# EAGLE design NFC Shield (EAGLE 6.3)
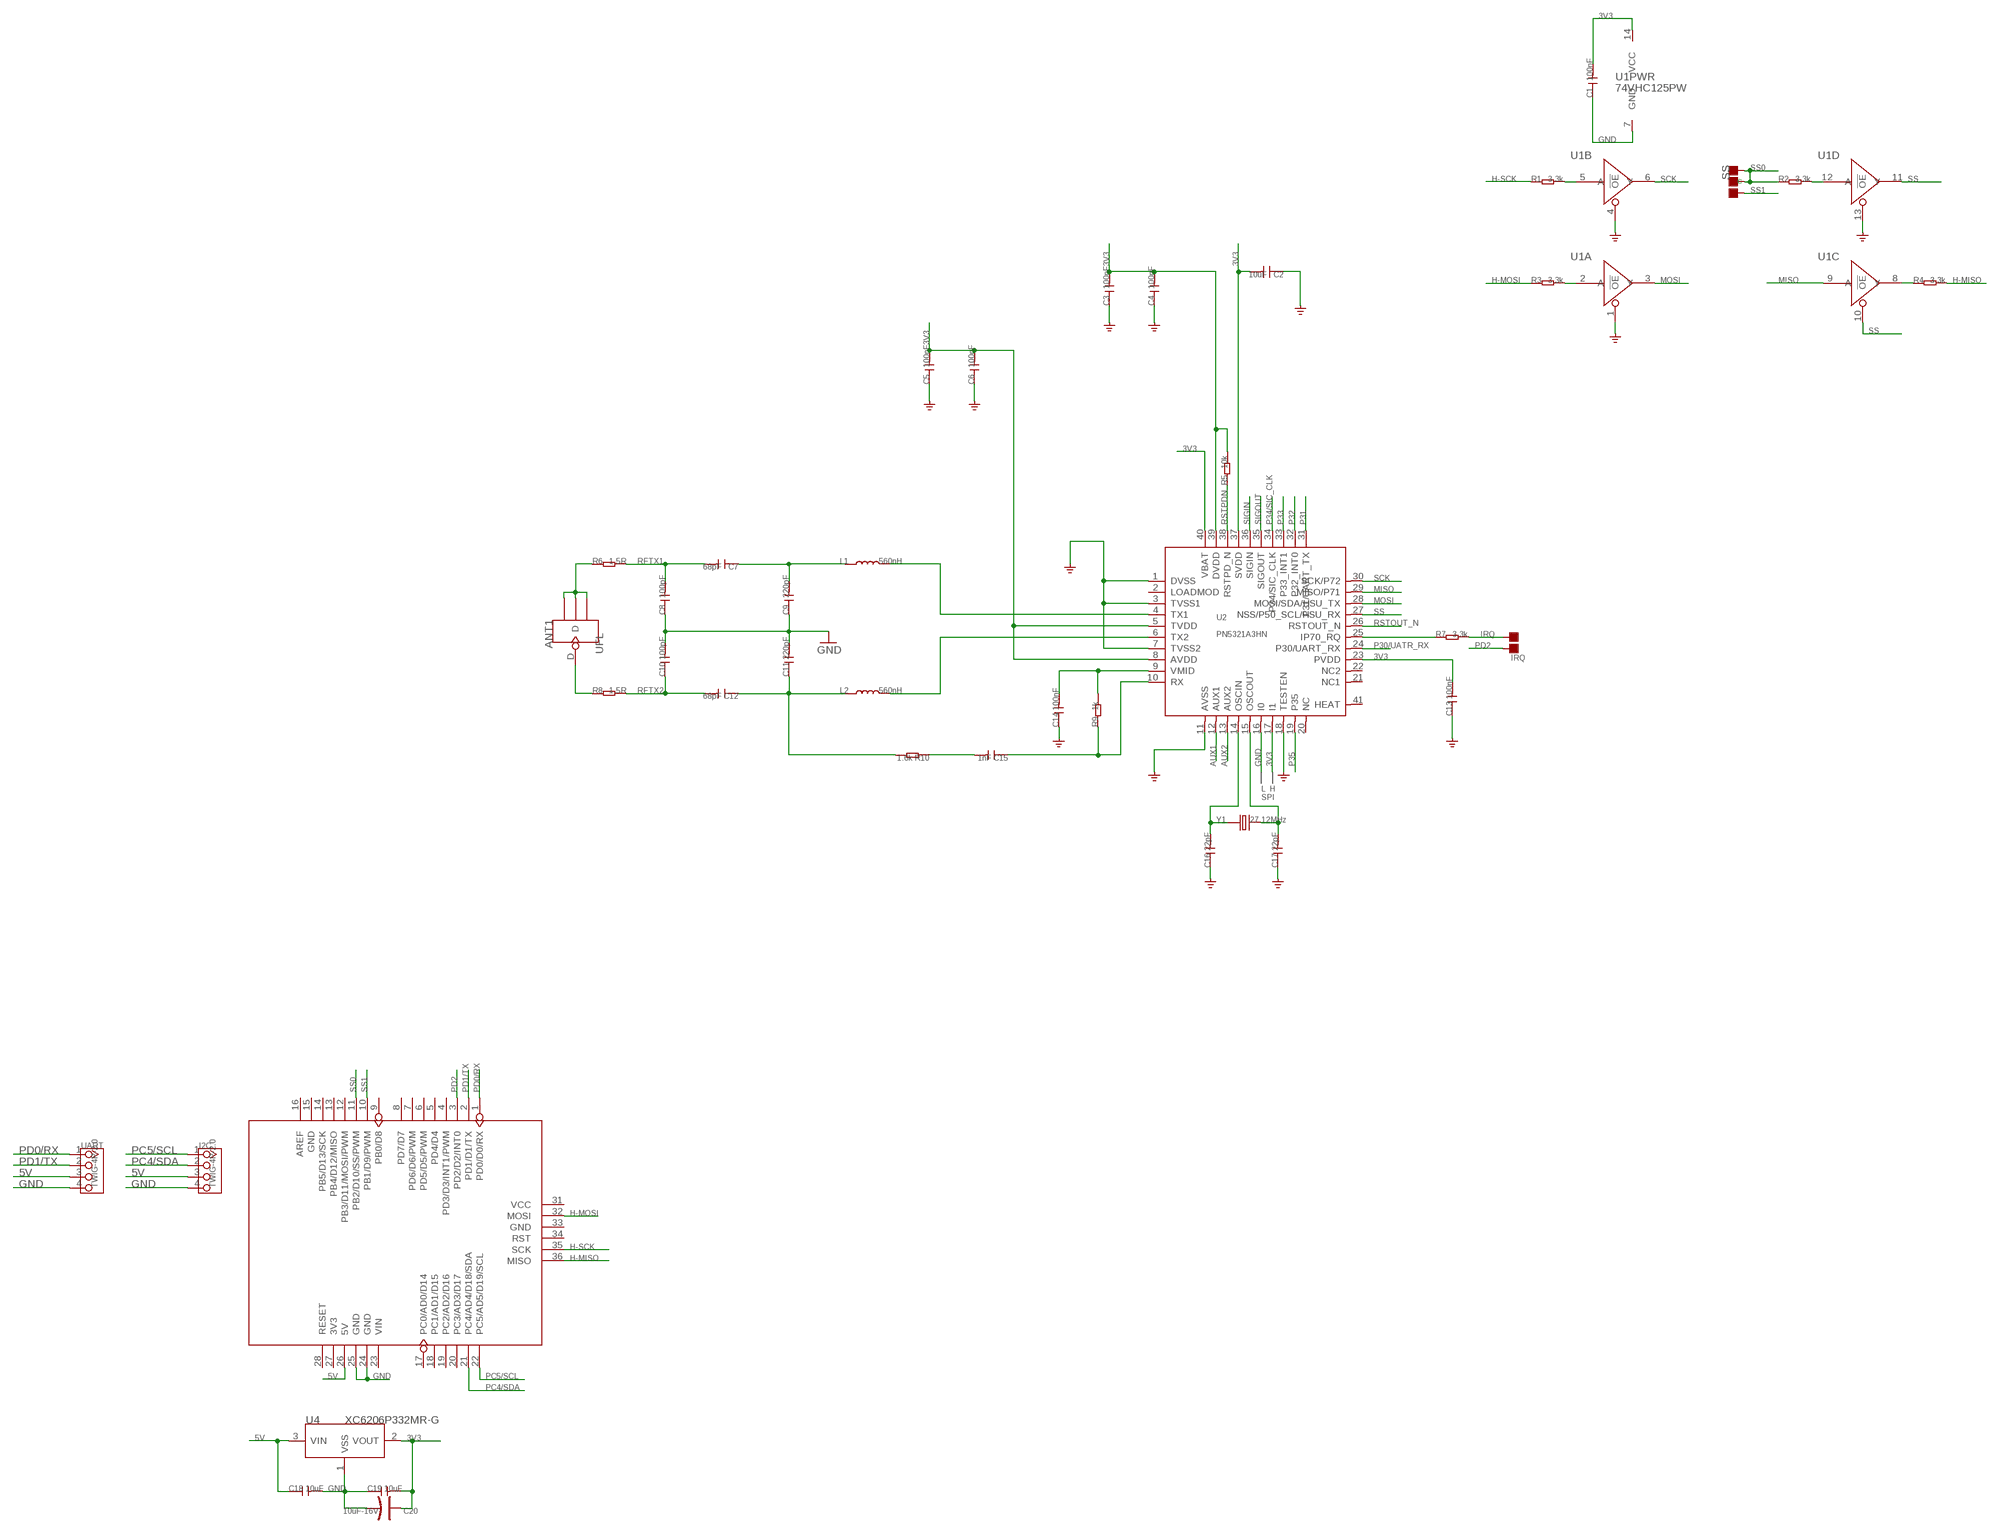
[diagram p0: schematic, sheet 1]

## Parts
ANT1  UFL  ANTENNA-U-FL  [4P-U-FL]
C1  100nF  C-0603  [C0603]
C2  10uF  C-0805  [0805]
C3  100nF  C-0603  [C0603]
C4  100nF  C-0603  [C0603]
C5  100nF  C-0603  [C0603]
C6  100nF  C-0603  [C0603]
C7  68pF  C-0603  [C0603]
C8  100pF  C-0603  [C0603]
C9  220pF  C-0603  [C0603]
C10  100pF  C-0603  [C0603]
C11  220pF  C-0603  [C0603]
C12  68pF  C-0603  [C0603]
C13  100nF  C-0603  [C0603]
C14  100nF  C-0603  [C0603]
C15  1nF  C-0603  [C0603]
C16  22pF  C-0603  [C0603]
C17  22pF  C-0603  [C0603]
C18  10uF  C-0805  [C0805]
C19  10uF  C-0805  [C0805]
C20  10uF-16V  CAP-AVX-A  [AVX-A]
I2C  TWIG-4P-2.0  TWIG-4P-2.0-2.0  [4P-2.0]
IRQ  DNP  PAD-JUMPER-2P  [2P-SMD-1.78X1.27]
L1  560nH  L'0805'  [L0805]
L2  560nH  L'0805'  [L0805]
R1  3.3k  R-0603  [R0603]
R2  3.3k  R-0603  [R0603]
R3  3.3k  R-0603  [R0603]
R4  3.3k  R-0603  [R0603]
R5  10k  R-0603  [R0603]
R6  1.5R  R-0603  [R0603]
R7  3.3k  R-0603  [R0603]
R8  1.5R  R-0603  [R0603]
R9  1k  R-0603  [R0603]
R10  1.6k  R-0603  [R0603]
SS  DNP  PAD-JUMPER-3P-40*40  [3P-SMD-4.1X1.5]
U1  74VHC125PW  [TSSOP14]
U2  PN5321A3HN  PN532-HVQFN40  [HVQFN40]
U3  ARDUINO'W/-SILK  [ARDUINO]
U4  XC6206P332MR-G  XC6206MR  [SOT23]
UART  TWIG-4P-2.0  TWIG-4P-2.0-2.0  [4P-2.0]
Y1  27.12MHz  CRYSTAL'HC49S'  [HC49/S]

## Nets
3V3: C1.2 C2.2 C3.2 C4.2 C5.2 C6.2 C13.2 C19.2 C20.+ R5.2 U1.14(PWR:VCC) U2.5(TVDD) U2.8(AVDD) U2.17(I1) U2.23(PVDD) U2.37(SVDD) U2.39(DVDD) U2.40(VBAT) U4.2(VOUT)
5V: C18.1 I2C.3 U3.26(5V) U4.3(VIN) UART.3
AUX1: U2.12(AUX1)
AUX2: U2.13(AUX2)
GND: C1.1 C2.1 C3.1 C4.1 C5.1 C6.1 C8.1 C9.1 C10.2 C11.2 C13.1 C14.1 C16.1 C17.1 C18.2 C19.1 C20.- I2C.4 U1.1(A:!OE) U1.4(B:!OE) U1.7(PWR:GND) U1.13(D:!OE) U2.1(DVSS) U2.3(TVSS1) U2.7(TVSS2) U2.11(AVSS) U2.16(I0) U2.18(TESTEN) U3.24(GND) U3.25(GND) U4.1(VSS) UART.4
H-MISO: R4.2 U3.36(MISO)
H-MOSI: R3.1 U3.32(MOSI)
H-SCK: R1.1 U3.35(SCK)
IRQ: IRQ.1 R7.2
MISO: U1.9(C:A) U2.29(MISO/P71)
MOSI: U1.3(A:Y) U2.28(MOSI/SDA/HSU_TX)
N$1: C16.2 U2.14(OSCIN) Y1.1
N$2: C17.2 U2.15(OSCOUT) Y1.2
N$3: L2.2 U2.6(TX2)
N$4: L1.2 U2.4(TX1)
N$5: C7.1 C9.2 L1.1
N$6: C15.2 R10.1
N$7: C11.1 C12.1 L2.1 R10.2
N$8: R1.2 U1.5(B:A)
N$9: C14.2 R9.2 U2.9(VMID)
N$10: R2.2 U1.12(D:A)
N$11: C15.1 R9.1 U2.10(RX)
N$12: R4.1 U1.8(C:Y)
N$13: R3.2 U1.2(A:A)
N$14: R7.1 U2.25(IP70_RQ)
N$17: ANT1.D R8.1
N$18: ANT1.GND1 ANT1.GND2 ANT1.GND3 R6.1
P30/UATR_RX: U2.24(P30/UART_RX)
P31: U2.31(P31/UART_TX)
P32: U2.32(P32_INT0)
P33: U2.33(P33_INT1)
P34/SIC_CLK: U2.34(P34/SIC_CLK)
P35: U2.19(P35)
PC4/SDA: I2C.2 U3.21(PC4/AD4/D18/SDA)
PC5/SCL: I2C.1 U3.22(PC5/AD5/D19/SCL)
PD0/RX: U3.1(PD0/D0/RX) UART.1
PD1/TX: U3.2(PD1/D1/TX) UART.2
PD2: IRQ.2 U3.3(PD2/D2/INT0)
RFTX1: C7.2 C8.2 R6.2
RFTX2: C10.1 C12.2 R8.2
RSTOUT_N: U2.26(RSTOUT_N)
RSTPDN: R5.1 U2.38(RSTPD_N)
SCK: U1.6(B:Y) U2.30(SCK/P72)
SIGIN: U2.36(SIGIN)
SIGOUT: U2.35(SIGOUT)
SS: U1.10(C:!OE) U1.11(D:Y) U2.27(NSS/P50_SCL/HSU_RX)
SS0: R2.1 SS.11(R) SS.MM(C) U3.11(PB2/D10/SS/PWM)
SS1: SS.00(L) U3.10(PB1/D9/PWM)
Unconnected: U2.2(LOADMOD) U2.20(NC) U2.21(NC1) U2.22(NC2) U2.41(HEAT) U3.4(PD3/D3/INT1/PWM) U3.5(PD4/D4) U3.6(PD5/D5/PWM) U3.7(PD6/D6/PWM) U3.8(PD7/D7) U3.9(PB0/D8) U3.12(PB3/D11/MOSI/PWM) U3.13(PB4/D12/MISO) U3.14(PB5/D13/SCK) U3.15(GND) U3.16(AREF) U3.17(PC0/AD0/D14) U3.18(PC1/AD1/D15) U3.19(PC2/AD2/D16) U3.20(PC3/AD3/D17) U3.23(VIN) U3.27(3V3) U3.28(RESET) U3.31(VCC) U3.33(GND) U3.34(RST)

## Notes on the sheet
- L | H
- SPI

## Library data of the parts
ANT1 = Connector:ANTENNA-U-FL
C1 C3-C19 = Discrete:C*: Ceramic Capacitors
C2 = Discreter:C*: Ceramic Capacitors
C20 = Discrete:CAP*: Electrolytic Capacitors,Tantalum Capacitors and Super Capacitors
I2C UART = Connector:TWIG-4P-2.0
IRQ = Discrete:PAD-JUMPER-2P; PARTNO: DNP
L1 L2 = Discrete:L*
R1-R10 = Discrete:R*
SS = Discrete:PAD-JUMPER-3P; PARTNO: DNP
U1 = IC:74V*125: Quad Buffer/Line Driver;3-state
U2 = IC:PN532: NFC Controller http://www.adafruit.com/datasheets/pn532ds.pdf
U3 = moudle:ARDUINO
U4 = IC:XC6206: LOW ESR Cap.Compatible Positive Voltage Regulators
Y1 = Discrete:CRYSTAL*: CRYSTAL

## Net classes
0 default: width 0.203 mm, drill 0.305 mm, clearance 0.152 mm
3 usbvcc: width 0.203 mm, drill 0.305 mm, clearance 0.203 mm

## Board
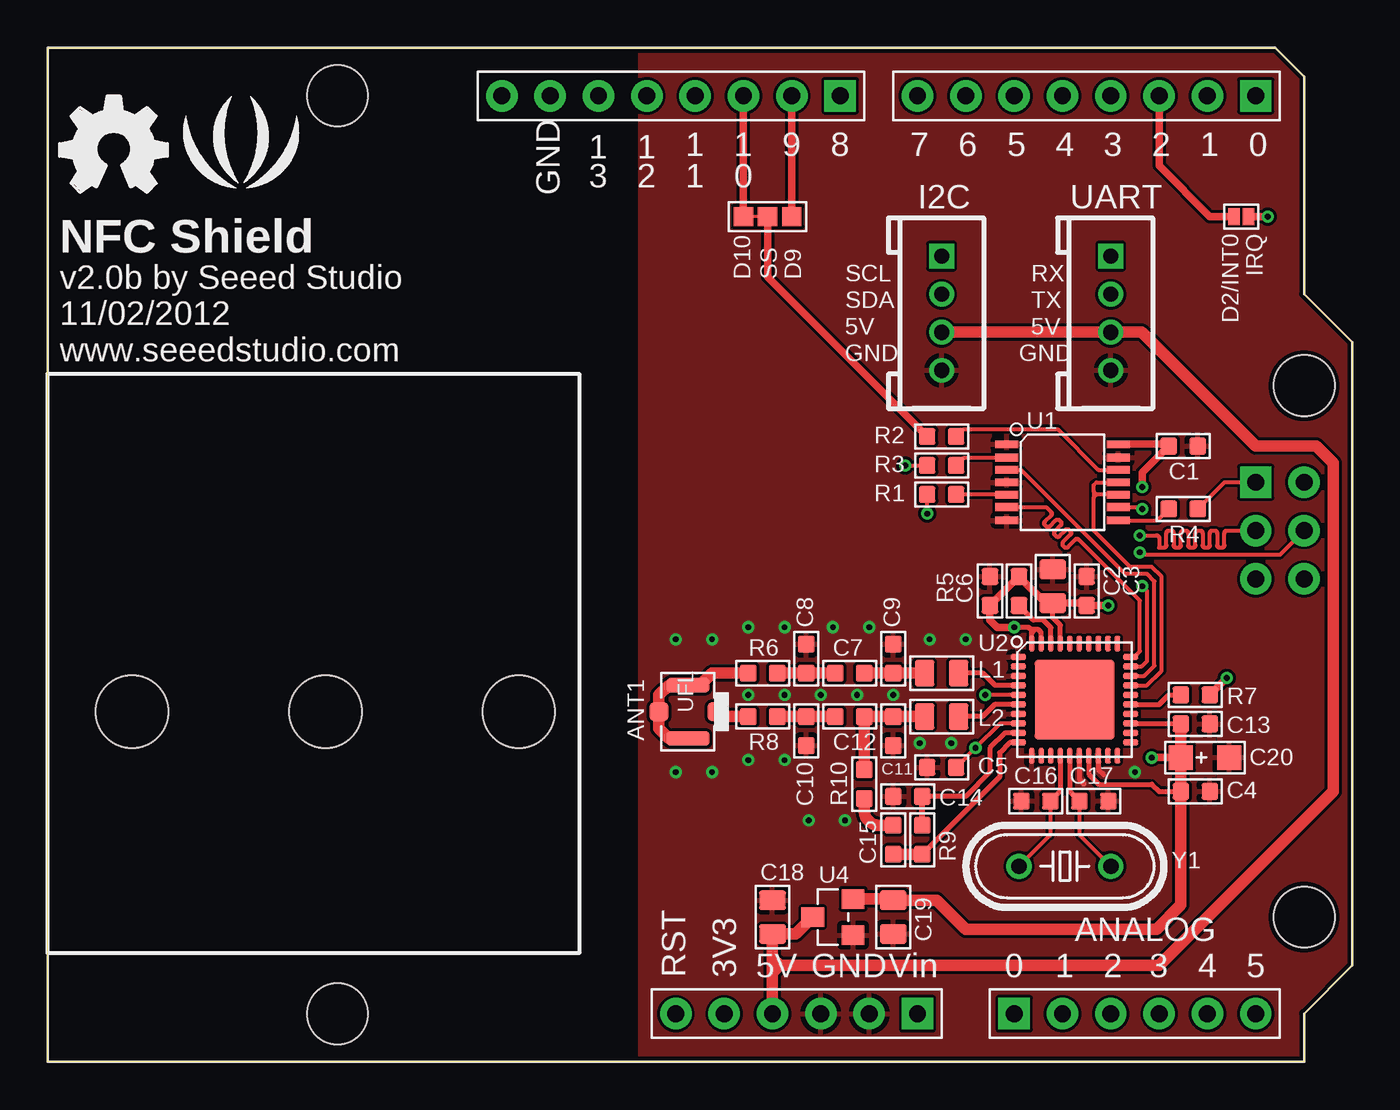
[diagram p1: board, top side]
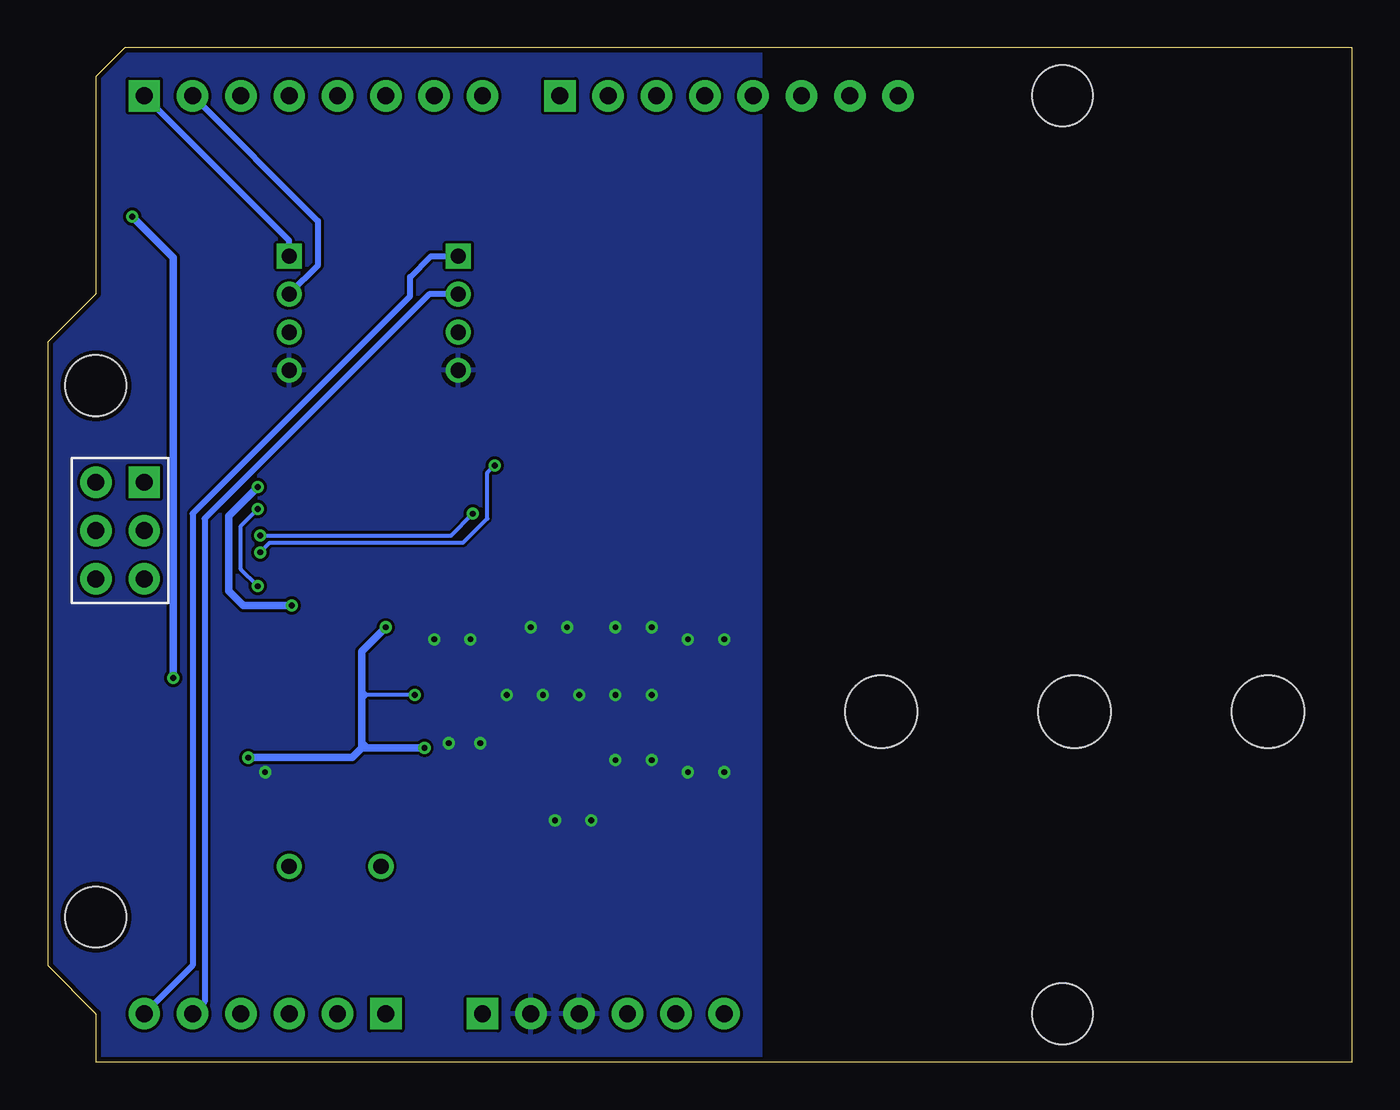
[diagram p2: board, bottom side, seen from below]

Size 68.58 x 53.34 mm. Coordinates in mm from the lower left corner, seen from the top.
Outline: 0,53.34 64.52,53.34 66.04,51.82 66.04,40.39 68.58,37.85 68.58,5.08 66.04,2.54 66.04,0 0,0 0,53.34
Copper layers (1*16): Top 0.035mm / dielectric 1.5mm / Bottom 0.035mm
Design rules "SeeedStudio_rule_no_angle_090911 *": minimum track width 6mil, minimum drill 12mil, track to track 6mil, track to pad 6mil, pad to pad 6mil, via to via 6mil, smd to smd 0mil, copper to edge 10mil, drill to drill 10mil, minimum pad ring 10mil, minimum via ring 6mil, stop-mask expansion 2mil, vias tented up to drill 100mil, thermal gap 10mil
Holes 3.81 mm at 24.77,18.41 14.61,18.41 4.45,18.41
Holes 3.2 mm at 15.24,2.54
tRestrict: area 0,0 to 30.5,33; area 51.4,16.5 to 56.5,21.6
bRestrict: area 0,0 to 30.5,33

### Footprints (pad centres in the part's own frame; a part is rotated, then mirrored left to right if it is on the bottom)
4P-U-FL = smd 1.016 x 1.016: D -1.524,0; GND3 1.524,0 | smd 2.286 x 0.762: GND1 0,1.397; GND2 0,-1.397
C0603 = smd 0.889 x 0.889: 1 -0.762,0; 2 0.762,0
0805 = smd 1.016 x 1.397: 1 -0.889,0; 2 0.889,0
C0805 = smd 1.016 x 1.397: 1 -0.889,0; 2 0.889,0
AVX-A = smd 1.27 x 1.27: + -1.27,0; - 1.27,0
4P-2.0 = drill 0.8 pad 1.27 square: 1 -3,0 | drill 0.8 pad 1.27: 2 -1,0; 3 1,0; 4 3,0
2P-SMD-1.78X1.27 = smd 0.889 x 0.61: 1 0,0.381; 2 0,-0.381
L0805 = smd 1.016 x 1.397: 1 -0.889,0; 2 0.889,0
R0603 = smd 0.889 x 0.889: 1 -0.762,0; 2 0.762,0
3P-SMD-4.1X1.5 = smd 1.016 x 1.016: 00 -1.27,0; 11 1.27,0; MM 0,0
TSSOP14 = smd 0.4 x 1.2: 1 -2,-2.925; 2 -1.3,-2.925; 3 -0.65,-2.925; 4 0,-2.925; 5 0.65,-2.925; 6 1.3,-2.925; 7 2,-2.925; 8 2,2.925; 9 1.3,2.925; 10 0.65,2.925; 11 0,2.925; 12 -0.65,2.925; 13 -1.3,2.925; 14 -2,2.925
HVQFN40 = smd 0.8 x 0.3: 1 -2.95,2.25; 2 -2.95,1.75; 3 -2.95,1.25; 4 -2.95,0.75; 5 -2.95,0.25; 6 -2.95,-0.25; 7 -2.95,-0.75; 8 -2.95,-1.25; 9 -2.95,-1.75; 10 -2.95,-2.25; 21 2.95,-2.25; 22 2.95,-1.75; 23 2.95,-1.25; 24 2.95,-0.75; 25 2.95,-0.25; 26 2.95,0.25; 27 2.95,0.75; 28 2.95,1.25; 29 2.95,1.75; 30 2.95,2.25 | smd 0.3 x 0.8: 11 -2.25,-2.95; 12 -1.75,-2.95; 13 -1.25,-2.95; 14 -0.75,-2.95; 15 -0.25,-2.95; 16 0.25,-2.95; 17 0.75,-2.95; 18 1.25,-2.95; 19 1.75,-2.95; 20 2.25,-2.95; 31 2.25,2.95; 32 1.75,2.95; 33 1.25,2.95; 34 0.75,2.95; 35 0.25,2.95; 36 -0.25,2.95; 37 -0.75,2.95; 38 -1.25,2.95; 39 -1.75,2.95; 40 -2.25,2.95 | smd 4.2 x 4.2: 41 0,0
ARDUINO = drill 0.889 pad 1.651 square: 1 63.5,50.8; 9 41.656,50.8; 17 50.8,2.54; 23 45.72,2.54; 36 63.5,30.48 | drill 0.889 pad 1.651: 2 60.96,50.8; 3 58.42,50.8; 4 55.88,50.8; 5 53.34,50.8; 6 50.8,50.8; 7 48.26,50.8; 8 45.72,50.8; 10 39.116,50.8; 11 36.576,50.8; 12 34.036,50.8; 13 31.496,50.8; 14 28.956,50.8; 15 26.416,50.8; 16 23.876,50.8; 18 53.34,2.54; 19 55.88,2.54; 20 58.42,2.54; 21 60.96,2.54; 22 63.5,2.54; 24 43.18,2.54; 25 40.64,2.54; 26 38.1,2.54; 27 35.56,2.54; 28 33.02,2.54; 31 66.04,30.48; 32 66.04,27.94; 33 66.04,25.4; 34 63.5,25.4; 35 63.5,27.94 | hole 3.2: 15.24,50.8; 66.04,35.56; 66.04,7.62
SOT23 = smd 1.016 x 1.2: 1 -0.95,-1.06; 2 0.95,-1.06; 3 0,1.06
HC49/S = drill 0.813: 1 -2.413,0; 2 2.413,0

### Placement (x,y rotation side)
ANT1  33.66,18.41 180 top
C1  59.69,32.38 180 top
C2  52.83,25.02 270 top
C3  54.61,24.77 270 top
C4  60.33,14.22 180 top
C5  46.99,15.49 0 top
C6  49.53,24.77 270 top
C7  42.16,20.45 180 top
C8  39.88,21.21 270 top
C9  44.45,21.21 270 top
C10  39.88,17.4 270 top
C11  44.45,17.4 270 top
C12  42.16,18.16 180 top
C13  60.33,17.78 180 top
C14  45.21,13.97 0 top
C15  44.45,11.68 90 top
C16  51.94,13.72 0 top
C17  54.99,13.72 180 top
C18  38.1,7.62 90 top
C19  44.45,7.62 90 top
C20  60.83,16 0 top
I2C  46.99,39.37 270 top
IRQ  62.74,44.45 270 top
L1  46.99,20.45 0 top
L2  46.99,18.16 0 top
R1  46.99,29.84 0 top
R2  46.99,32.89 0 top
R3  46.99,31.37 0 top
R4  59.69,29.08 0 top
R5  51.05,24.77 90 top
R6  37.59,20.45 0 top
R7  60.33,19.3 0 top
R8  37.59,18.16 0 top
R9  45.97,11.68 90 top
R10  42.93,14.61 90 top
SS  37.85,44.45 180 top
U1  53.34,30.48 270 top
U2  53.98,19.05 0 top
U3  0,0 0 top
U4  41.27,7.62 90 top
U$1  [OSHW_FILLX200_NOTEXT]  0.64,45.72 0 top
U$2  [LOGO_SILK]  10.16,47.62 0 top
UART  55.88,39.37 270 top
Y1  53.47,10.29 0 top

### Tracks (layer width: path | path; a pad name or v marks a point on that pad's centre or on a via)
3V3  (via drill 0.3 pad 0.64)
  Top 0.203: U2.8 50.06,17.8 v48.77,16.51 C5.2 | U2.5 v49.28,19.3
  Top 0.254: U2.17 54.73,15.12 55.24,14.61 58.04,14.61 58.42,14.22 C4.2 | U2.37 53.23,22.98 52.83,23.37 C2.2 | U2.23 59.54,17.8 C13.2 | U2.40 51.73,22.53 | 51.73,22.53 51.73,22.64 arc45 51.69,22.73 51.65,22.77 | U2.39 52.23,22.52 arc45 52.19,22.61 52.07,22.73 51.88,22.73 | 51.88,22.73 51.74,22.73 arc-45 51.65,22.77 | 51.73,22.53 arc-45 51.76,22.62 51.88,22.73 | 51.65,22.77 51.56,22.86 v50.8,22.86
  Top 0.406: C20.+ v58.04,16 | v50.8,22.86 49.91,22.86 49.53,23.24 C6.2 R5.2 52.45,24.13 C2.2 54.48,24.13 C3.2 v55.75,24 | v57.53,30.23 57.53,30.99 C1.2 58.83,32.48 U1.14
  Top 0.61: U4.2 44.39,8.57 C19.2 46.74,8.51 48.26,6.99 58.29,6.99 59.56,8.26 C4.2 C20.+ C13.2
  Bottom 0.203: v49.28,19.3 51.82,19.3 | 51.82,19.3 52.07,19.56 | 52.07,19.05 51.82,19.3
  Bottom 0.406: v58.04,16 52.58,16 52.07,16.51 | 52.07,16.76 52.07,19.05 52.07,19.56 52.07,21.59 v50.8,22.86 | v48.77,16.51 51.82,16.51 | 52.07,16.51 51.82,16.51 | 51.82,16.51 52.07,16.76 | 52.07,16.76 52.07,16.51 | v55.75,24 58.29,24 59.05,24.77 59.05,28.7 v57.53,30.23
5V
  Top 0.61: U3.26 38.1,4.7 | 38.1,4.7 38.1,5.08 | 38.1,5.08 38.1,5.46 | 38.1,5.46 C18.1 39.33,6.73 U4.3 | I2C.3 UART.3 57.52,38.37 63.5,32.38 66.67,32.38 67.56,31.5 67.56,14.22 58.42,5.08 38.48,5.08 | 38.48,5.08 38.1,5.08 | 38.48,5.08 38.1,5.46 | 38.1,4.7 38.48,5.08
GND  (via drill 0.3 pad 0.64)
  Top 0.254: U2.16 54.23,14.86 54.48,14.61 | U2.18 55.23,15.39 55.5,15.11
  other vias: 57.15,15.24 34.92,22.23 44.45,19.3 42.55,19.3 40.64,19.3 38.73,19.3 36.83,19.3 36.83,22.86 45.85,16.76 47.5,16.76 48.26,22.23 46.35,22.23 43.18,22.86 41.27,22.86 38.73,22.86 33.02,22.23 33.02,15.24 34.92,15.24 36.83,15.88 38.73,15.88 41.91,12.7 40.01,12.7
  pour Top: 31.11,53.34 31.11,0 66.04,0 66.04,2.54 68.58,5.08 68.58,37.85 66.04,40.39 66.04,51.82 64.52,53.34
  pour Bottom: 31.11,53.34 31.11,0 66.04,0 66.04,2.54 68.58,5.08 68.58,37.85 66.04,40.39 66.04,51.82 64.52,53.34
H-MISO
  Top 0.203: U3.36 61.85,30.48 R4.2
H-MOSI  (via drill 0.3 pad 0.64)
  Top 0.203: U3.32 64.77,26.67 57.53,26.67 v57.4,26.8 | v45.09,31.37 R3.1
  Bottom 0.203: v57.4,26.8 56.9,27.3 46.74,27.3 45.47,28.57 45.47,30.99 v45.09,31.37
H-SCK  (via drill 0.3 pad 0.64)
  Top 0.203: v46.23,28.83 R1.1 | v57.4,27.69 58.29,27.69 arc-90 58.42,27.56 58.42,27.05 58.67,27.05 arc90 58.8,27.18 58.8,27.81 arc-90 58.93,27.94 59.05,27.94 arc-90 59.18,27.81 59.18,27.18 arc90 59.31,27.05 59.44,27.05 arc90 59.56,27.18 59.56,27.81 arc-90 59.69,27.94 59.82,27.94 arc-90 59.94,27.81 59.94,27.18 arc90 60.07,27.05 60.2,27.05 arc90 60.33,27.18 60.33,27.81 arc-90 60.45,27.94 60.58,27.94 arc-90 60.71,27.81 60.71,27.18 arc90 60.83,27.05 60.96,27.05 arc90 61.09,27.18 61.09,27.81 arc-90 61.21,27.94 61.34,27.94 arc-90 61.47,27.81 61.47,27.18 arc90 61.59,27.05 61.72,27.05 arc90 61.85,27.18 61.85,27.81 arc-90 61.98,27.94 U3.35
  Bottom 0.203: v57.4,27.69 47.37,27.69 v46.23,28.83
IRQ  (via drill 0.3 pad 0.64)
  Top 0.406: R7.2 v61.98,20.19 | IRQ.1 v64.14,44.45
  Bottom 0.406: v61.98,20.19 61.98,42.29 v64.14,44.45
MISO  (via drill 0.3 pad 0.64)
  Top 0.203: U2.29 57.5,20.8 57.78,21.08 57.78,24.77 v57.53,25.02 | U1.9 57.43,29.18 v57.53,29.08
  Bottom 0.203: v57.53,25.02 58.42,25.91 58.42,28.19 v57.53,29.08
MOSI
  Top 0.203: U2.28 57.64,20.3 58.17,20.83 58.17,25.27 57.78,25.65 56.64,25.65 51.17,31.13 U1.3
N$1
  Top 0.203: C16.2 52.7,12.02 arc-45 52.65,11.88 Y1.1
  Top 0.254: U2.14 53.23,14.24 C16.2
N$2
  Top 0.203: C17.2 54.23,12.02 arc45 54.28,11.88 Y1.2
  Top 0.254: U2.15 53.73,14.22 C17.2
N$3
  Top 0.254: U2.6 49.79,18.8 49.15,18.16 L2.2
N$4
  Top 0.254: U2.4 49.8,19.8 49.15,20.45 L1.2
N$5
  Top 0.61: L1.1 C9.2 C7.1
N$6
  Top 0.61: R10.1 42.93,13.21 arc90 43.69,12.45 C15.2
N$7
  Top 0.61: L2.1 C11.1 C12.1 R10.2
N$8
  Top 0.203: R1.2 47.77,29.83 U1.5
N$9
  Top 0.254: U2.9 50.32,17.3 49.53,16.51 49.53,15.24 48.26,13.97 C14.2
  Top 0.305: R9.2 C14.2
N$10
  Top 0.203: R2.2 48.13,33.27 53.09,33.27 55.23,31.13 U1.12
N$11
  Top 0.254: U2.10 50.58,16.8 50.04,16.26 50.04,14.99 R9.1
  Top 0.61: C15.1 R9.1
N$12
  Top 0.203: U1.8 58.33,28.48 R4.1
N$13
  Top 0.203: R3.2 48.16,31.78 U1.2
N$14
  Top 0.254: U2.25 58.42,18.8 58.93,19.3 R7.1
N$17
  Top 0.61: R8.1 35.43,18.16 ANT1.D
N$18
  Top 0.61: R6.1 34.92,20.45 34.29,19.81 ANT1.GND2 32.64,19.81 32.13,19.3 ANT1.GND3 32.13,17.53 32.64,17.02 ANT1.GND1
PC4/SDA
  Bottom 0.305: I2C.2 48.53,40.37 60.33,28.57 60.33,3.17 U3.21
PC5/SCL
  Bottom 0.305: I2C.1 48.44,42.37 49.53,41.27 49.53,40.26 60.96,28.83 60.96,5.08 U3.22
PD0/RX
  Bottom 0.305: UART.1 55.88,43.13 arc-45 55.92,43.22 U3.1
PD1/TX
  Bottom 0.305: UART.2 arc45 55.87,40.4 54.36,41.91 54.36,44.14 arc-45 54.39,44.23 U3.2
PD2
  Top 0.406: U3.3 58.42,47.12 61.09,44.45 IRQ.2
RFTX1
  Top 0.61: C7.2 C8.2 R6.2
RFTX2
  Top 0.61: C12.2 C10.1 R8.2
RSTPDN
  Top 0.254: U2.38 52.73,22.84 52.32,23.24 51.82,23.24 R5.1
SCK
  Top 0.203: U2.30 57.11,21.3 57.4,21.59 57.4,24.26 54.19,27.47 arc90 54.01,27.47 53.62,27.08 arc-90 53.44,27.08 53.37,27.15 arc-90 53.37,27.33 53.76,27.72 arc90 53.76,27.9 53.68,27.98 arc90 53.5,27.98 53.18,27.65 arc-90 53,27.65 52.92,27.72 arc-90 52.92,27.9 53.25,28.23 arc90 53.25,28.41 53.18,28.48 arc90 53,28.48 52.67,28.16 arc-90 52.49,28.16 52.41,28.23 arc-90 52.41,28.41 52.74,28.74 arc90 52.74,28.92 52.48,29.18 U1.6
SS
  Top 0.203: U2.27 57.77,19.8 58.55,20.57 58.55,25.52 58.03,26.04 56.9,26.04 54.99,27.94 54.99,29.7 | 54.99,29.97 54.99,29.7 | U1.10 55.12,29.83 | 55.12,29.83 54.99,29.96 54.99,30.35 55.12,30.48 U1.11 | 54.99,29.7 55.12,29.83
SS0
  Top 0.152: SS.MM SS.11
  Top 0.406: U3.11 SS.11 | R2.1 37.85,41.27 SS.MM
SS1
  Top 0.406: SS.00 U3.10

### Text on the board
tPlace: D2/INT0 | NFC Shield | D10 | D9 | SCL | RX | SDA | TX | 5V | 5V | v2.0b by Seeed Studio / 11/02/2012 / www.seeedstudio.com | GND | GND